# EAGLE design Fihl54-xtalOven (EAGLE 7.7.0)
EMNE: xtal ovn; NAVN: OZ1AAB
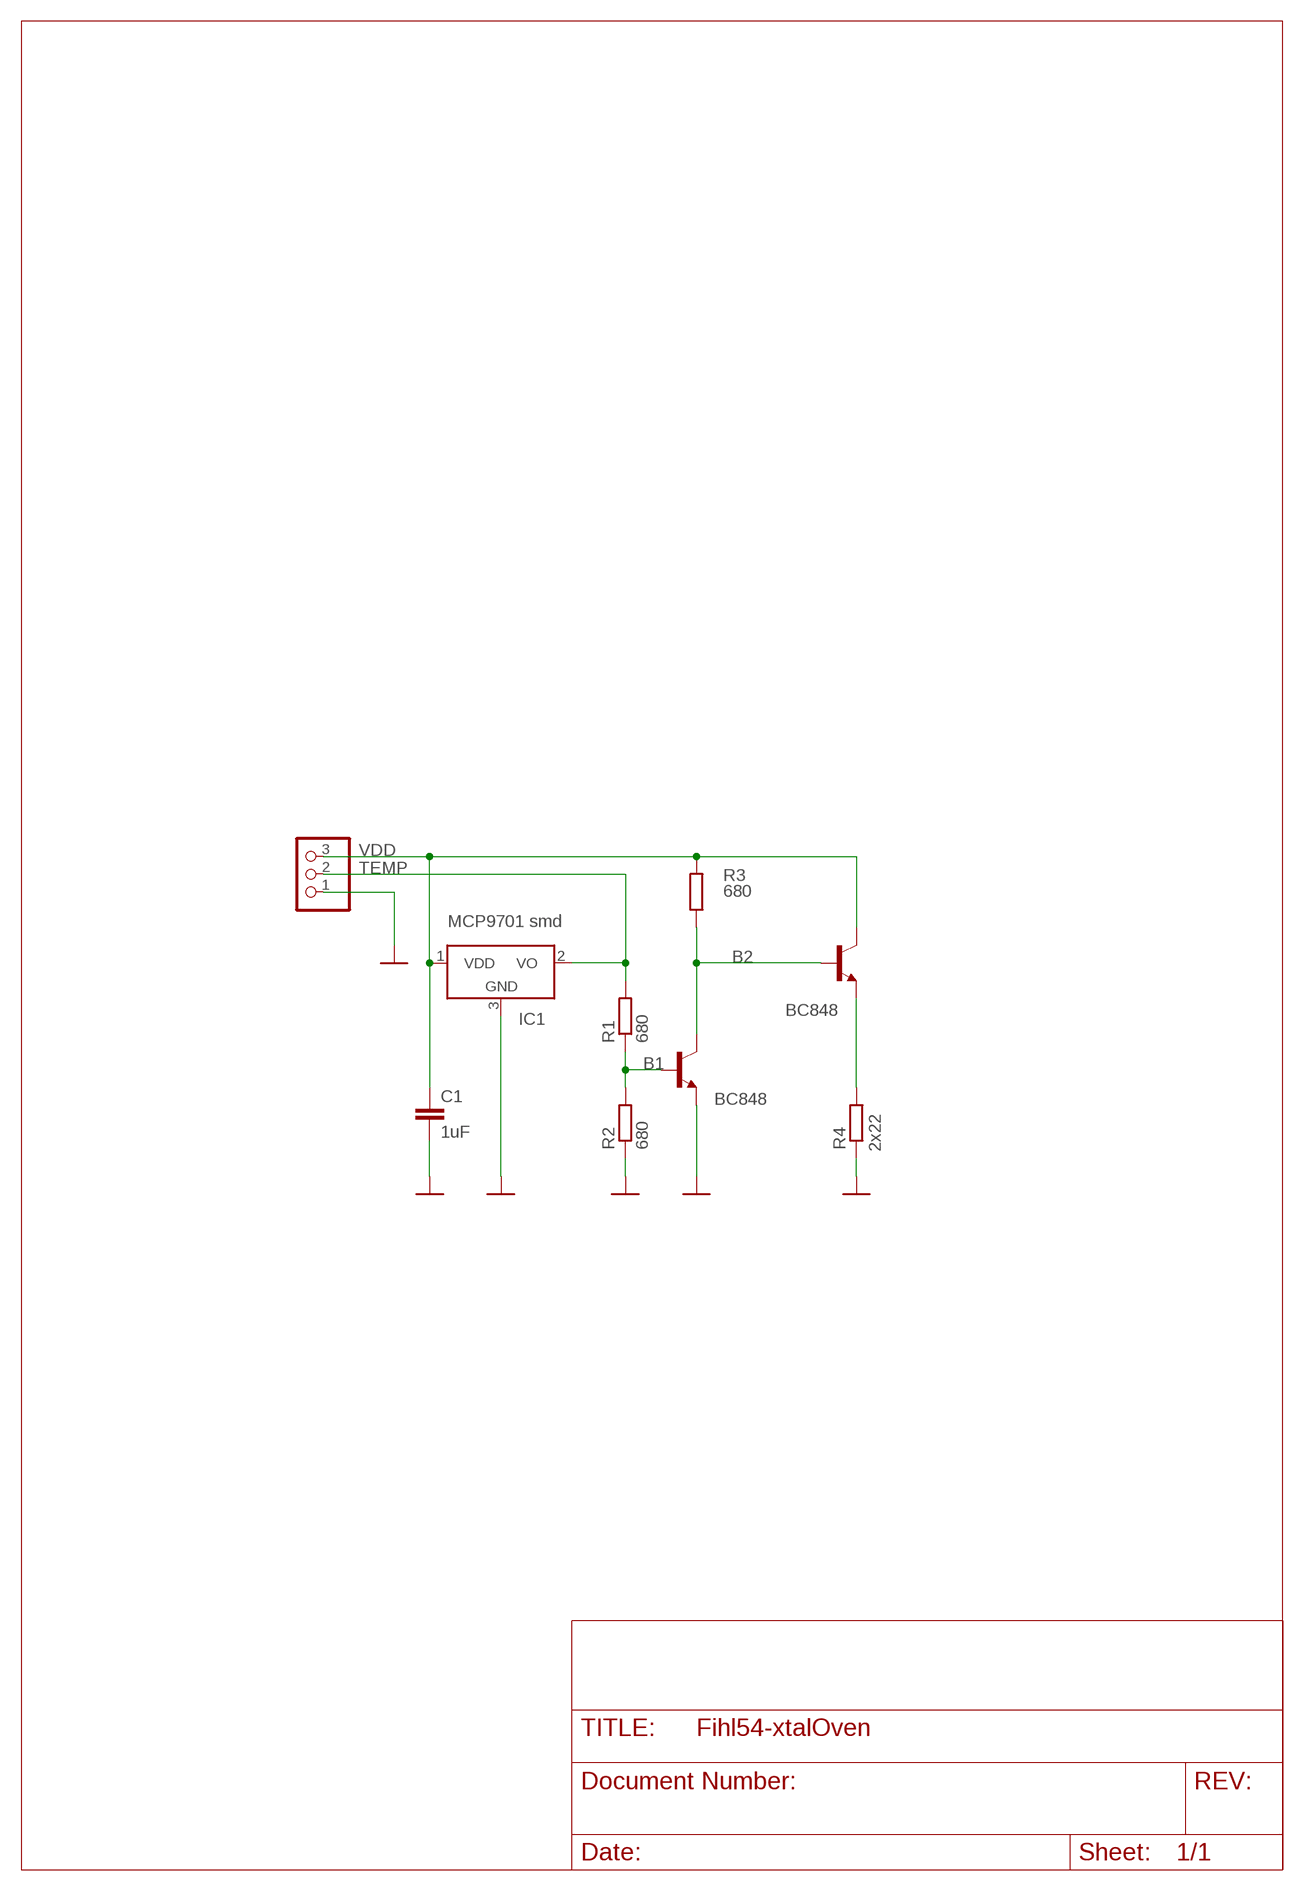
[diagram p0: schematic, sheet 1]

## Parts
C1  1uF  CAPX5R  [C1210]
IC1  MCP9701 smd  MCP9700T  [SOT23-3]
JP1  jp1  PINHD-1X3  [1X03]
R1  680  R-EU_M1206  [M1206]
R2  680  R-EU_M1206  [M1206]
R3  680  R-EU_M1206  [M1206]
R4  2x22  R-EU_M1206  [M1206]
T1  BC848  [SOT23]
T2  BC848  [SOT23]

## Nets
B1: R1.1 R2.2 T1.1(B)
B2: R3.1 T1.3(C) T2.1(B)
E2: R4.2 T2.2(E)
GND: C1.2 IC1.3(GND) JP1.1 R2.1 R4.1 T1.2(E)
TEMP: IC1.2(VO) JP1.2 R1.2
VDD: C1.1 IC1.1(VDD) JP1.3 R3.2 T2.3(C)

## Library data of the parts
C1 = rcl:CAP: Fihls CAPACITOR 10uF/6V3(445-1363-1-ND), 100nF, 10nF, ..
IC1 = interGATE4:MCP9700T: SOT-23-3 Single-Supply Centigrade Temperature Sensor Vout = (10mV/°C x Temp °C) + ??? Digikey MCP9700T-E/TTCT-ND http://www.mouser.com/ds/2/268/21942e-53364.pdf
JP1 = pinhead:PINHD-1X3: PIN HEADER
R1-R4 = rcl:R-EU_: RESISTOR, European symbol
T1 T2 = transistor:BC848: NPN TRANSISTOR

## Board
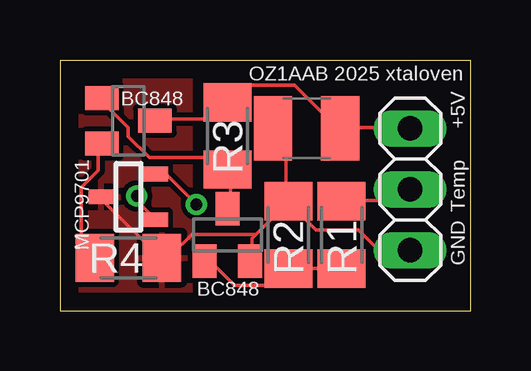
[diagram p1: board, top side]
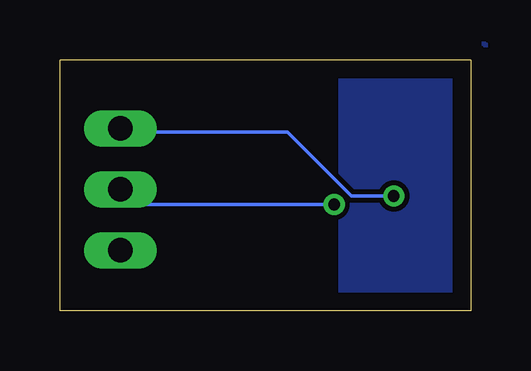
[diagram p2: board, bottom side, seen from below]

Size 17.12 x 10.48 mm. Coordinates in mm from the lower left corner, seen from the top.
Outline: 0,0 17.12,0 17.12,10.48 0,10.48 0,0
Copper layers (1*16): Top 0.035mm / dielectric 1.5mm / Bottom 0.035mm
Design rules "6 mil Badge 2 layer": minimum track width 6mil, minimum drill 19mil, track to track 8mil, track to pad 8mil, pad to pad 8mil, via to via 8mil, smd to smd 6mil, copper to edge 30mil, drill to drill 8mil, minimum pad ring 10mil, minimum via ring 8mil, stop-mask expansion 0mil, vias tented up to drill 0mil, thermal gap 10mil

### Footprints (pad centres in the part's own frame; a part is rotated, then mirrored left to right if it is on the bottom)
C1210 = smd 1.6 x 2.7: 1 -1.4,0; 2 1.4,0
SOT23-3 = smd 0.61 x 1.016: 1 -0.953,-1.143; 2 0.953,-1.143; 3 0,1.143
1X03 = drill 1.016 long: 1 -2.54,0; 2 0,0; 3 2.54,0
M1206 = smd 1.6 x 2: 1 -1.4,0; 2 1.4,0
SOT23 = smd 1 x 1.4: 1 -0.95,-1.1; 2 0.95,-1.1; 3 0,1.1

### Placement (x,y rotation side)
C1  10.29,7.62 180 top
IC1  2.86,4.76 90 top
JP1  14.61,5.08 90 top
R1  11.75,3.17 90 top
R2  9.53,3.17 270 top
R3  6.99,7.3 90 top
R4  2.86,2.22 180 top
T1  6.99,3.17 0 top
T2  2.86,7.94 270 top

### Tracks (layer width: path | path; a pad name or v marks a point on that pad's centre or on a via)
B1
  Top 0.152: T1.1 6.04,1.96 6.4,1.96 7.29,1.07 8.89,1.07 9.42,1.6 R2.2 9.6,1.78 11.73,1.78 R1.1
B2
  Top 0.152: T1.3 7.11,4.45 7.11,5.87 R3.1 6.93,6.04 6.58,6.4 3.73,6.4 2.85,7.29 2.85,7.64 1.78,8.71 T2.1
E2
  Top 0.152: T2.2 1.6,6.93 1.6,5.87 0.89,5.16 0.89,2.85 1.42,2.31 R4.2
GND
  Top 0.152: IC1.3 1.78,4.62 4.09,2.31 R4.1 4.27,2.31 4.62,2.31 5.51,3.2 8.18,3.2 | 8.18,3.2 9.42,4.45 R2.1 | 8.18,3.2 8,3.02 8,2.13 T1.2 | JP1.1 14.58,2.67 13.16,2.67 12.45,3.38 10.67,3.38 9.6,4.45 R2.1 | R2.1 9.42,4.62 9.42,6.93 8.89,7.47 C1.2
  pour Bottom: -0.64,11.11 5.4,11.11 5.4,0 -0.64,0
  pour Top: 0,10.79 5.4,10.79 5.4,-0.32 0,-0.32
TEMP  (via drill 0.48)
  Top 0.152: v5.69,4.45 4.45,5.69 4.09,5.69 IC1.2 | R1.2 11.91,4.62 14.22,4.62 14.58,4.98 JP1.2
  Bottom 0.152: v5.69,4.45 14.05,4.45 14.58,4.98 JP1.2
VDD  (via drill 0.48)
  Top 0.152: T2.3 4.09,8 6.4,8 6.93,8.53 R3.2 7.11,8.71 7.82,9.42 9.78,9.42 11.56,7.64 C1.1 11.73,7.64 14.58,7.64 JP1.3 | v3.2,4.8 3.2,4.62 3.91,3.91 IC1.1
  Bottom 0.152: v3.2,4.8 4.98,4.8 7.64,7.47 14.58,7.47 JP1.3

### Text on the board
tNames: OZ1AAB 2025 xtaloven | BC848 | +5V | Temp | MCP9701 | GND | BC848